# Altium schematic sheet WallMote Revision 3.schdoc
size 271 x 214 mm
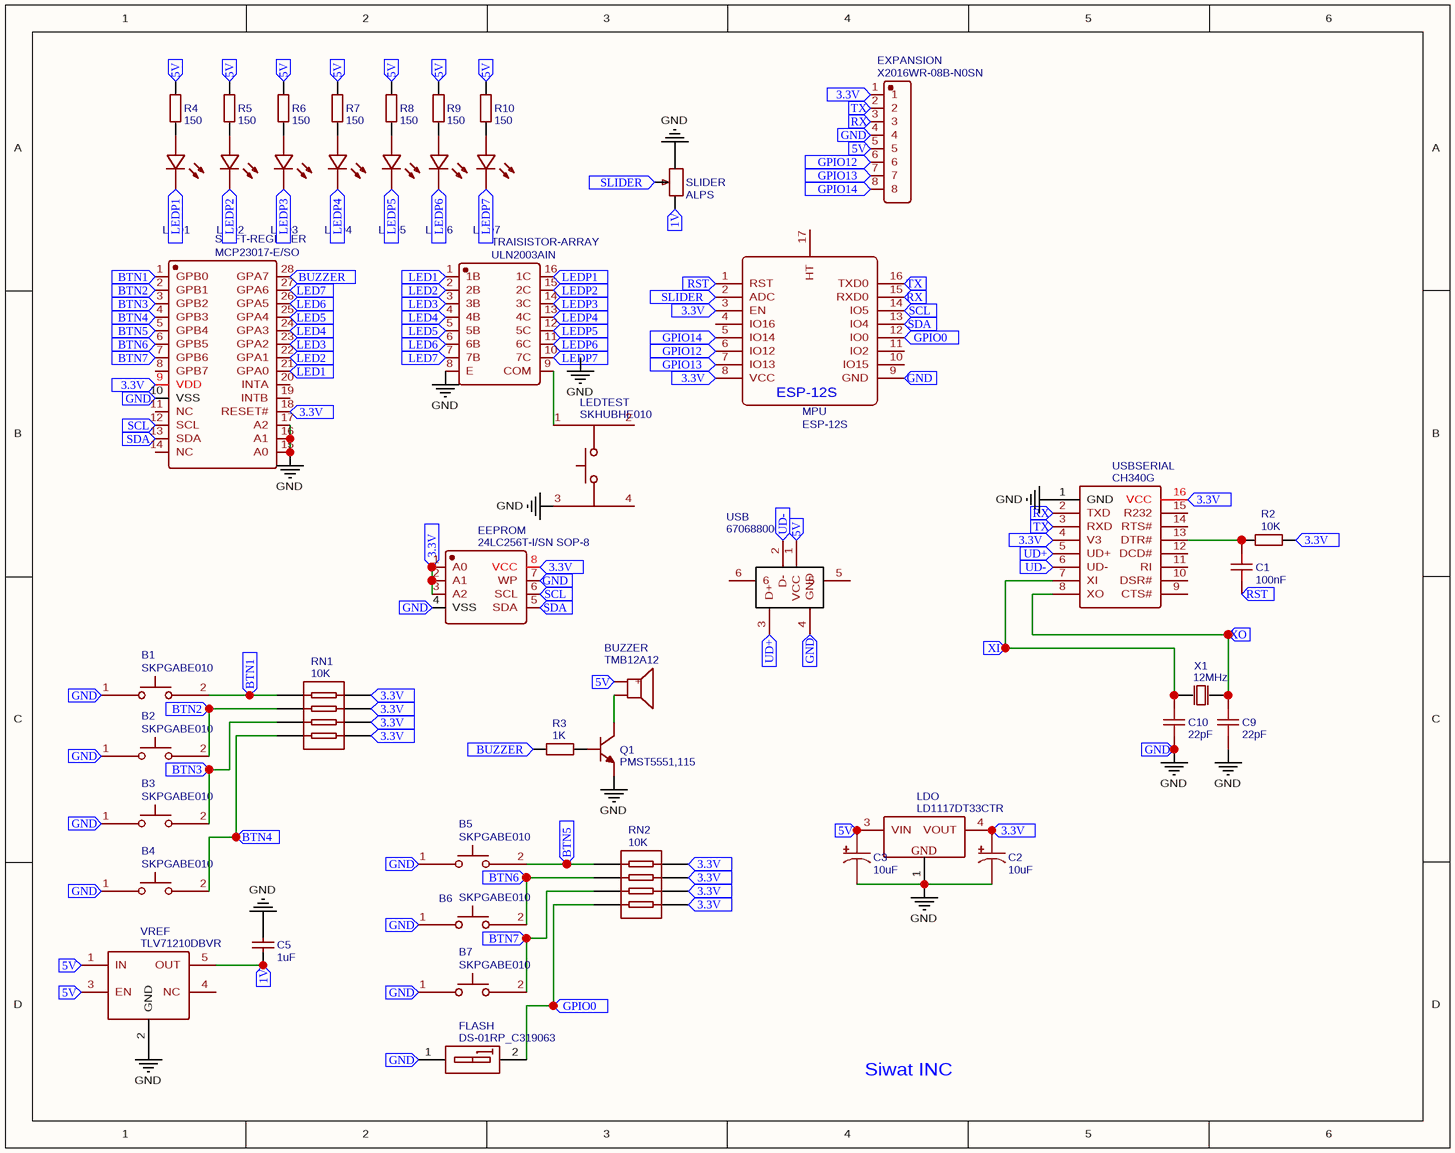
[diagram p0: WallMote Revision 3.schdoc]

## Parts
B1  SKPGABE010  [SW-SMD-6.6X6.3X5]
B2  SKPGABE010  [SW-SMD-6.6X6.3X5]
B3  SKPGABE010  [SW-SMD-6.6X6.3X5]
B4  SKPGABE010  [SW-SMD-6.6X6.3X5]
B5  SKPGABE010  [SW-SMD-6.6X6.3X5]
B6  SKPGABE010  [SW-SMD-6.6X6.3X5]
B7  SKPGABE010  [SW-SMD-6.6X6.3X5]
BUZZER  TMB12A12  [B-12*7.5]
C1  100nF  [0805]
C2  10uF  [CAP-T-8*7]
C3  10uF  [CAP-T-8*7]
C5  1uF  [0805]
C9  22pF  [CAP-CT4G-0805-2.54MM]
C10  22pF  [CAP-CT4G-0805-2.54MM]
EEPROM  24LC256T-I/SN SOP-8  [SOIC-8_L4.9-W3.9-P1.27-LS6.0-BL]
EXPANSION  X2016WR-08B-N0SN  [CONN-TH_8PIN-H-MALE-PITCH2.00-L_X2016WR-08B-N0SN]
FLASH  DS-01RP_C319063  [DS-01RP]
LDO  LD1117DT33CTR  [TO-252-2]
LED1  TJ-L3FYWGHRMFCSFLC2R-A5  [LED-3MM/2.54]  (value not drawn)
LED2  TJ-L3FYWGHRMFCSFLC2R-A5  [LED-3MM/2.54]  (value not drawn)
LED3  TJ-L3FYWGHRMFCSFLC2R-A5  [LED-3MM/2.54]  (value not drawn)
LED4  TJ-L3FYWGHRMFCSFLC2R-A5  [LED-3MM/2.54]  (value not drawn)
LED5  TJ-L3FYWGHRMFCSFLC2R-A5  [LED-3MM/2.54]  (value not drawn)
LED6  TJ-L3FYWGHRMFCSFLC2R-A5  [LED-3MM/2.54]  (value not drawn)
LED7  TJ-L3FYWGHRMFCSFLC2R-A5  [LED-3MM/2.54]  (value not drawn)
LEDTEST  SKHUBHE010  [SW-SMD-6.2X6.3X3.1-4P]
MPU  ESP-12S  [ESP-12S]
Q1  PMST5551,115  [SOT-323-3_L2.2-W1.3-P1.30-LS2.1-BL]
R2  10K  [0805]
R3  1K  [0805]
R4  150  [0805]
R5  150  [0805]
R6  150  [0805]
R7  150  [0805]
R8  150  [0805]
R9  150  [0805]
R10  150  [0805]
RN1  10K  [1206_X4]
RN2  10K  [1206_X4]
SHIFT-REGISTER  MCP23017-E/SO  [SOIC-28_300MIL]
SLIDER  ALPS  [RES-ADJ-TH_3PIN-V-L35.00-W8.00]
TRAISISTOR-ARRAY  ULN2003AIN  [PDIP-16_L22.1-W6.3-P2.54-LS7.6-BL]
USB  670688000  [USB-B-4P-DIP-12.0X17.0-H11.0-MOLEX]
USBSERIAL  CH340G  [SOIC-16_150MIL]
VREF  TLV71210DBVR  [SOT-23-5_L3.0-W1.7-P0.95-LS2.8-BL]
X1  12MHz  [OSC-49S-1]

## Ports
1V, 3.3V, 5V, BTN1, BTN2, BTN3, BTN4, BTN5, BTN6, BTN7, BUZZER, GND, GPIO0, GPIO12, GPIO13, GPIO14, LED1, LED2, LED3, LED4, LED5, LED6, LED7, LEDP1, LEDP2, LEDP3, LEDP4, LEDP5, LEDP6, LEDP7, RST, RX, SCL, SDA, SLIDER, TX, UD+, UD-, XI, XO

## Nets
GND: B1.1 B2.1 B3.1 B4.1 B5.1 B6.1 B7.1 C2.2 C3.2 C5.2 C9.1 C10.1 EEPROM.4(VSS) EEPROM.7(WP) EXPANSION.4 FLASH.1(A1) LDO.1(GND) LEDTEST.3 MPU.9(GND) Q1.2(E) SHIFT-REGISTER.10(VSS) SHIFT-REGISTER.15(A0) SHIFT-REGISTER.16(A1) SHIFT-REGISTER.17(A2) SLIDER.1 TRAISISTOR-ARRAY.8(E) USB.4(GND) USBSERIAL.1(GND) VREF.2(GND) ; port GND
1V: C5.1 SLIDER.3 VREF.5(OUT) ; port 1V
3.3V: C2.1 EEPROM.1(A0) EEPROM.2(A1) EEPROM.3(A2) EEPROM.8(VCC) EXPANSION.1 LDO.4(VOUT) MPU.3(EN) MPU.8(VCC) R2.2 RN1.5 RN1.6 RN1.7 RN1.8 RN2.5 RN2.6 RN2.7 RN2.8 SHIFT-REGISTER.9(VDD) SHIFT-REGISTER.18(RESET#) USBSERIAL.4(V3) USBSERIAL.16(VCC) ; port 3.3V
5V: BUZZER.1(+) C3.1 EXPANSION.5 LDO.3(VIN) R4.2 R5.2 R6.2 R7.2 R8.2 R9.2 R10.2 USB.1(VCC) VREF.1(IN) VREF.3(EN) ; port 5V
BTN1: B1.2 RN1.1 SHIFT-REGISTER.1(GPB0) ; port BTN1
BTN2: B2.2 RN1.2 SHIFT-REGISTER.2(GPB1) ; port BTN2
BTN3: B3.2 RN1.3 SHIFT-REGISTER.3(GPB2) ; port BTN3
BTN4: B4.2 RN1.4 SHIFT-REGISTER.4(GPB3) ; port BTN4
BTN5: B5.2 RN2.1 SHIFT-REGISTER.5(GPB4) ; port BTN5
BTN6: B6.2 RN2.2 SHIFT-REGISTER.6(GPB5) ; port BTN6
BTN7: B7.2 RN2.3 SHIFT-REGISTER.7(GPB6) ; port BTN7
BUZZER: R3.1 SHIFT-REGISTER.28(GPA7) ; port BUZZER
GPIO0: FLASH.2(A2) MPU.12(IO0) RN2.4 ; port GPIO0
GPIO12: EXPANSION.6 MPU.6(IO12) ; port GPIO12
GPIO13: EXPANSION.7 MPU.7(IO13) ; port GPIO13
GPIO14: EXPANSION.8 MPU.5(IO14) ; port GPIO14
LED1: SHIFT-REGISTER.21(GPA0) TRAISISTOR-ARRAY.1(1B) ; port LED1
LED2: SHIFT-REGISTER.22(GPA1) TRAISISTOR-ARRAY.2(2B) ; port LED2
LED3: SHIFT-REGISTER.23(GPA2) TRAISISTOR-ARRAY.3(3B) ; port LED3
LED4: SHIFT-REGISTER.24(GPA3) TRAISISTOR-ARRAY.4(4B) ; port LED4
LED5: SHIFT-REGISTER.25(GPA4) TRAISISTOR-ARRAY.5(5B) ; port LED5
LED6: SHIFT-REGISTER.26(GPA5) TRAISISTOR-ARRAY.6(6B) ; port LED6
LED7: SHIFT-REGISTER.27(GPA6) TRAISISTOR-ARRAY.7(7B) ; port LED7
LEDP1: LED1.2 TRAISISTOR-ARRAY.16(1C) ; port LEDP1
LEDP2: LED2.2 TRAISISTOR-ARRAY.15(2C) ; port LEDP2
LEDP3: LED3.2 TRAISISTOR-ARRAY.14(3C) ; port LEDP3
LEDP4: LED4.2 TRAISISTOR-ARRAY.13(4C) ; port LEDP4
LEDP5: LED5.2 TRAISISTOR-ARRAY.12(5C) ; port LEDP5
LEDP6: LED6.2 TRAISISTOR-ARRAY.11(6C) ; port LEDP6
LEDP7: LED7.2 TRAISISTOR-ARRAY.10(7C) ; port LEDP7
RST: C1.1 MPU.1(RST) ; port RST
RX: EXPANSION.3 MPU.15(RXD0) USBSERIAL.2(TXD) ; port RX
SCL: EEPROM.6(SCL) MPU.14(IO5) SHIFT-REGISTER.12(SCL) ; port SCL
SDA: EEPROM.5(SDA) MPU.13(IO4) SHIFT-REGISTER.13(SDA) ; port SDA
SLIDER: MPU.2(ADC) SLIDER.2 ; port SLIDER
TX: EXPANSION.2 MPU.16(TXD0) USBSERIAL.3(RXD) ; port TX
UD+: USB.3(D+) USBSERIAL.5(UD+) ; port UD+
UD-: USB.2(D-) USBSERIAL.6(UD-) ; port UD-
XI: C10.2 USBSERIAL.7(XI) X1.2(OSC2) ; port XI
XO: C9.2 USBSERIAL.8(XO) X1.1(OSC1) ; port XO
NetBUZZER_2: BUZZER.2 Q1.3(C)
NetC1_2: C1.2 R2.1 USBSERIAL.13(DTR#)
NetLED1_1: LED1.1 R4.1
NetLED2_1: LED2.1 R5.1
NetLED3_1: LED3.1 R6.1
NetLED4_1: LED4.1 R7.1
NetLED5_1: LED5.1 R8.1
NetLED6_1: LED6.1 R9.1
NetLED7_1: LED7.1 R10.1
NetLEDTEST_1: LEDTEST.1 TRAISISTOR-ARRAY.9(COM)
NetQ1_1: Q1.1(B) R3.2

Not connected (* = marked no-connect by the designer): LEDTEST 2 4; MPU 4(IO16) 10(IO15) 11(IO2) 17(HT); SHIFT-REGISTER 8(GPB7) 11(NC) 14(NC) 19(INTB) 20(INTA); USB 5 6; USBSERIAL 9(CTS#) 10(DSR#) 11(RI) 12(DCD#) 14(RTS#) 15(R232); VREF 4(NC)

## Notes on the sheet
- Siwat INC
- Labels drawn without touching a wire or pin: GND

## Library data of the parts
B1-B7 = SKPGABE010: BOM_Manufacturer: ALPS Electric; Contributor: LCSC; BOM_Supplier: LCSC; BOM_Supplier Part: C139774; BOM_Manufacturer Part: SKPGABE010; spicePre: S
BUZZER = TMB12A12: BOM_Manufacturer: HNDZ; BOM_Supplier: LCSC; BOM_Manufacturer Part: TMB12A12; BOM_Supplier Part: C96079; spicePre: B
C1 = 100nF: BOM_Manufacturer: TORCH; BOM_Manufacturer Part: CT41G-0805-2X1-50V-0.1uF-K(N); nameAlias: Capacitance; Contributor: LCSC; BOM_Supplier: LCSC; BOM_Supplier Part: C126469; spicePre: C; spiceSymbolName: CT41G-0805-2X1-50V-0.1UF-K(N)
C2 C3 = 10uF: BOM_Manufacturer: Lite-On Semicon; BOM_Manufacturer Part: OCV100M1ETR-0807; nameAlias: Capacitance; Contributor: LCSC; BOM_Supplier: LCSC; BOM_Supplier Part: C134853; spicePre: C; spiceSymbolName: OCV100M1ETR-0807
C5 = 1uF: BOM_Manufacturer: YAGEO; BOM_Manufacturer Part: CC0805KKX7R9BB105; nameAlias: Capacitance; BOM_Supplier: LCSC; BOM_Supplier Part: C91185; spicePre: C; spiceSymbolName: CC0805KKX7R9BB105
C9 C10 = 22pF: BOM_Manufacturer: Dersonic; BOM_Manufacturer Part: CC1H220JA1FDCH4B10MF; nameAlias: Capacitance; Contributor: LCSC; BOM_Supplier: LCSC; BOM_Supplier Part: C254096; spicePre: C; spiceSymbolName: CC1H220JA1FDCH4B10MF
EEPROM = 24LC256T-I/SN SOP-8: BOM_Manufacturer: MICROCHIP; SMT Type: Extend; spicePre: X; BOM_Supplier: LCSC; BOM_Manufacturer Part: 24LC256T-I/SN SOP-8; image: //image.lceda.cn/szlcsc/C5458.jpg; BOM_Supplier Part: C5458; BOM_LCSC Assembly: Yes
EXPANSION = X2016WR-08B-N0SN: BOM_Manufacturer: XKB Enterprise; Contributor: LCSC; BOM_Supplier: LCSC; BOM_Supplier Part: C388727; BOM_Manufacturer Part: X2016WR-08B-N0SN; spicePre: C
FLASH = DS-01RP_C319063: BOM_Manufacturer: XKB Enterprise; Contributor: LCSC; BOM_Supplier: LCSC; BOM_Supplier Part: C319063; BOM_Manufacturer Part: DS-01RP; spicePre: S
LDO = LD1117DT33CTR: BOM_Manufacturer: STMicroelectronics; SMT Type: Extend; BOM_Supplier: LCSC; BOM_Manufacturer Part: LD1117DT33CTR; image: //image.lceda.cn/szlcsc/C36395.jpg; BOM_Supplier Part: C36395; BOM_LCSC Assembly: Yes; spicePre: U
LED1-LED7 = TJ-L3FYWGHRMFCSFLC2R-A5: BOM_Manufacturer: TOGIALED; Contributor: LCSC; BOM_Supplier: LCSC; BOM_Supplier Part: C331041; BOM_Manufacturer Part: TJ-L3FYWGHRMFCSFLC2R-A5; spicePre: L
LEDTEST = SKHUBHE010: BOM_Manufacturer: ALPS Electric; Contributor: LCSC; BOM_Supplier: LCSC; BOM_Supplier Part: C139768; BOM_Manufacturer Part: SKHUBHE010; spicePre: S
MPU = ESP-12S: BOM_Manufacturer: Ai-Thinker; Contributor: LCSC; BOM_Supplier: LCSC; BOM_Manufacturer Part: ESP-12S; BOM_Supplier Part: C82898; spicePre: U
Q1 = PMST5551,115: BOM_Manufacturer: Nexperia; SMT Type: Extend; BOM_Supplier: LCSC; BOM_Manufacturer Part: PMST5551,115; BOM_Supplier Part: C132366; BOM_LCSC Assembly: Yes; spicePre: Q
R2 = 10K: BOM_Manufacturer: UniOhm; BOM_Manufacturer Part: 0805W8F1002T5E; nameAlias: Resistance (Ohms); SMT Type: Basic; BOM_Supplier: LCSC; BOM_LCSC Assembly: Yes; BOM_Supplier Part: C17414; spicePre: R; spiceSymbolName: 0805W8F1002T5E
R3 = 1K: BOM_Manufacturer: LIZ; BOM_Manufacturer Part: CR0805F81001G; nameAlias: Resistance (Ohms); BOM_Supplier: LCSC; BOM_Supplier Part: C101404; spicePre: R; spiceSymbolName: CR0805F81001G
R4-R10 = 150: BOM_Manufacturer: UniOhm; BOM_Manufacturer Part: 0805W8F1500T5E; nameAlias: Resistance (Ohms); SMT Type: Basic; BOM_Supplier: LCSC; BOM_LCSC Assembly: Yes; BOM_Supplier Part: C17471; spicePre: R; spiceSymbolName: 0805W8F1500T5E
RN1 RN2 = 10K: BOM_Manufacturer: Ever Ohms Tech; BOM_Manufacturer Part: CRA064RJ10KE04; nameAlias: Resistance (Ohms); Contributor: LCSC; BOM_Supplier: LCSC; BOM_Supplier Part: C183863; spicePre: R; spiceSymbolName: CRA064RJ10KE04
SHIFT-REGISTER = MCP23017-E/SO: BOM_Manufacturer: MICROCHIP; Contributor: LCSC; BOM_Supplier: LCSC; BOM_Manufacturer Part: MCP23017-E/SO; image: //image.lceda.cn/szlcsc/C47023.jpg; BOM_Supplier Part: C47023; spicePre: U
SLIDER = ALPS: BOM_Manufacturer: ALPS Electric; BOM_Manufacturer Part: RS201111J011; nameAlias: Value; Contributor: LCSC; BOM_Supplier: LCSC; BOM_Supplier Part: C255504; spicePre: R; spiceSymbolName: RS201111J011_C255504
TRAISISTOR-ARRAY = ULN2003AIN: BOM_Manufacturer: Texas Instruments; Contributor: LCSC; BOM_Supplier: LCSC; BOM_Supplier Part: C90838; BOM_Manufacturer Part: ULN2003AIN; spicePre: U
USB = 670688000: BOM_Manufacturer: MOLEX; Contributor: LCSC; BOM_Supplier: LCSC; BOM_Supplier Part: C114097; BOM_Manufacturer Part: 670688000; spicePre: U
USBSERIAL = CH340G: BOM_Manufacturer: WCH; SMT Type: Basic; timeStamp: 1468327462; BOM_Supplier: LCSC; BOM_Manufacturer Part: CH340G; BOM_LCSC Assembly: Yes; image: //image.lceda.cn/szlcsc/C14267.jpg; BOM_Supplier Part: C14267; spicePre: U
VREF = TLV71210DBVR: BOM_Manufacturer: TI; SMT Type: Extend; BOM_Supplier: LCSC; BOM_Manufacturer Part: TLV71210DBVR; image: //image.lceda.cn/szlcsc/C40254.jpg; BOM_Supplier Part: C40254; BOM_LCSC Assembly: Yes; spicePre: U
X1 = 12MHz: BOM_Manufacturer: YXC; BOM_Manufacturer Part: X49SD12MSD2SC; nameAlias: Frequency; BOM_Supplier: LCSC; BOM_Supplier Part: C16369; spicePre: X; spiceSymbolName: X49SD12MSD2SC